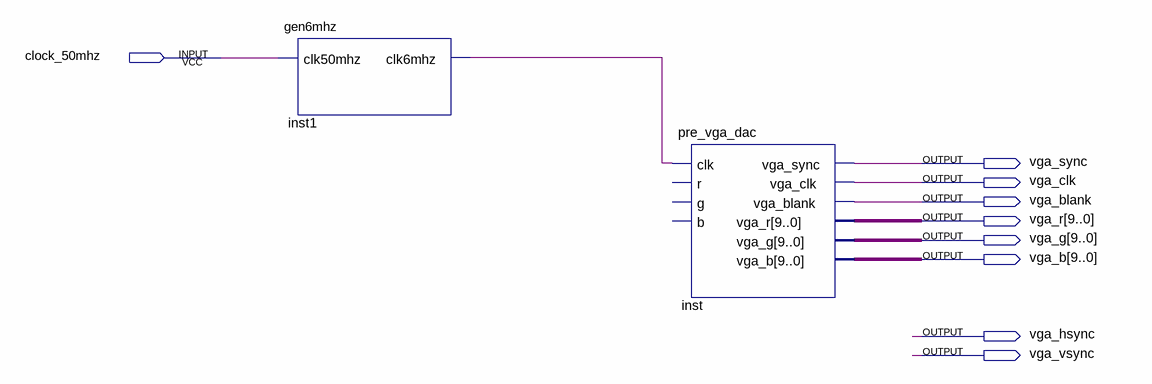
[diagram p0: schematic sheet]
// Quartus schematic top_de2.bdf as structural Verilog: 2 symbols, 9 pins
module top_de2 (
  input  clock_50mhz,
  output vga_sync,
  output vga_clk,
  output vga_blank,
  output [9:0] vga_r,
  output [9:0] vga_g,
  output [9:0] vga_b,
  output vga_hsync,
  output vga_vsync
);

  wire inst1_clk6mhz;

  gen6mhz inst1 (.clk50mhz(clock_50mhz), .clk6mhz(inst1_clk6mhz));
  pre_vga_dac inst (
    .clk(inst1_clk6mhz), .vga_sync(vga_sync), .vga_clk(vga_clk), .vga_blank(vga_blank), .vga_r(vga_r),
    .vga_g(vga_g), .vga_b(vga_b));  // open: r, g, b
endmodule
